# Altium schematic sheet Navigation_Controll.SchDoc
size A4
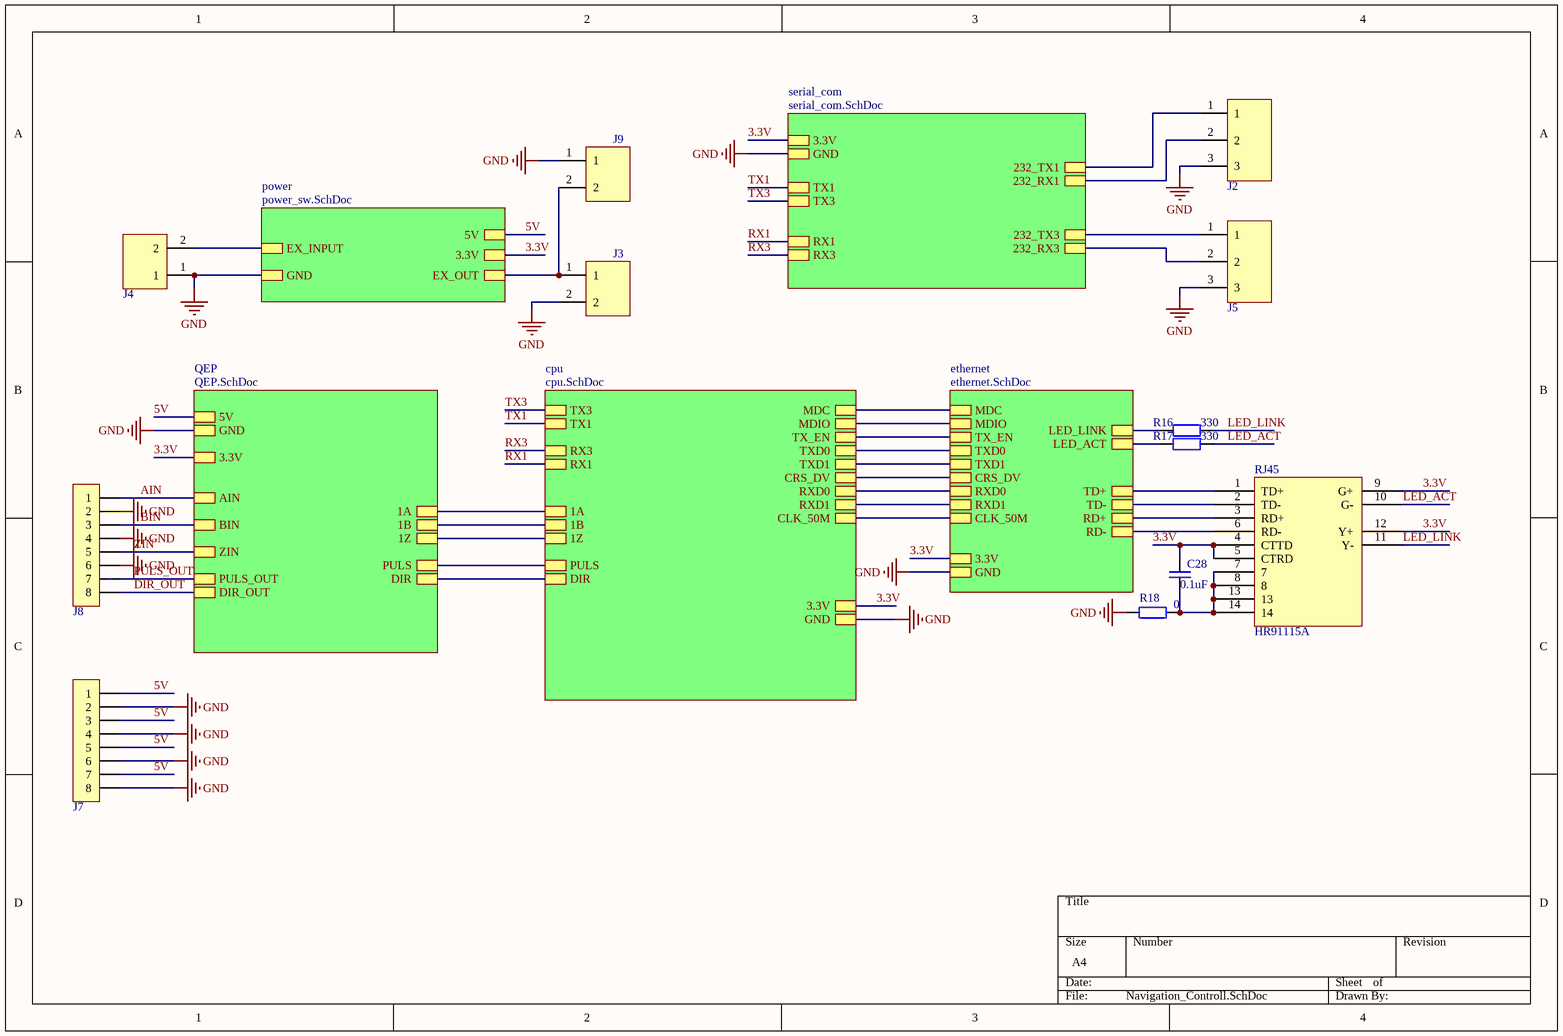
[diagram p0: Navigation_Controll.SchDoc]

## Parts
C28  value 0.1uF  [CAP-0805]  (hidden comment: CAP)
J2  DG3P  [DG381-3P]  (value not drawn)
J3  DG2P  [DG381-2P]  (value not drawn)
J4  DG2P  [DG508-2P]  (value not drawn)
J5  DG3P  [DG381-3P]  (value not drawn)
J7  HDR1*8  [KF128L-8P]  (value not drawn)
J8  HDR1*8  [KF128L-8P]  (value not drawn)
J9  DG2P  [DG381-2P]  (value not drawn)
R16  value 330  [RES-0805]  (hidden comment: RES)
R17  value 330  [RES-0805]  (hidden comment: RES)
R18  value 0  [RES-0805]  (hidden comment: RES)
RJ45  HR91115A  [RJ45_ISO]

## Sub-sheets
cpu = cpu.SchDoc: 1A, 1B, 1Z, PULS, DIR, TX3, TX1, RX3, RX1, MDC, MDIO, TX_EN, TXD0, TXD1, CRS_DV, RXD0, RXD1, CLK_50M, 3.3V, GND
ethernet = ethernet.SchDoc: MDC, MDIO, TX_EN, TXD0, TXD1, CRS_DV, RXD0, RXD1, CLK_50M, 3.3V, GND, LED_LINK, LED_ACT, TD+, TD-, RD+, RD-
power = power_sw.SchDoc: EX_INPUT, GND, 5V, 3.3V, EX_OUT
QEP = QEP.SchDoc: 5V, GND, 3.3V, AIN, BIN, ZIN, PULS_OUT, DIR_OUT, 1A, 1B, 1Z, PULS, DIR
serial_com = serial_com.SchDoc: 3.3V, GND, TX1, TX3, RX3, RX1, 232_TX1, 232_RX1, 232_TX3, 232_RX3

## Nets
GND: J2.3 J3.2 J4.1 J5.3 J7.2 J7.4 J7.6 J7.8 J8.2 J8.4 J8.6 J9.1 R18.1 ; sheet cpu/GND, sheet ethernet/GND, sheet power/GND, sheet serial_com/GND, sheet QEP/GND
3.3V: C28.2 RJ45.4(CTTD) RJ45.5(CTRD) RJ45.9(G+) RJ45.12(Y+) ; sheet cpu/3.3V, sheet ethernet/3.3V, sheet power/3.3V, sheet serial_com/3.3V, sheet QEP/3.3V
5V: J7.1 J7.3 J7.5 J7.7 ; sheet power/5V, sheet QEP/5V
AIN: J8.1 ; sheet QEP/AIN
BIN: J8.3 ; sheet QEP/BIN
DIR_OUT: J8.8 ; sheet QEP/DIR_OUT
LED_ACT: R17.2 RJ45.10(G-)
LED_LINK: R16.2 RJ45.11(Y-)
PULS_OUT: J8.7 ; sheet QEP/PULS_OUT
RX1: sheet cpu/RX1, sheet serial_com/RX1
RX3: sheet cpu/RX3, sheet serial_com/RX3
TX1: sheet cpu/TX1, sheet serial_com/TX1
TX3: sheet cpu/TX3, sheet serial_com/TX3
ZIN: J8.5 ; sheet QEP/ZIN
NetC28_1: C28.1 R18.2 RJ45.7 RJ45.8 RJ45.13 RJ45.14
NetJ2_1: J2.1 ; sheet serial_com/232_TX1
NetJ2_2: J2.2 ; sheet serial_com/232_RX1
NetJ3_1: J3.1 J9.2 ; sheet power/EX_OUT
NetJ4_2: J4.2 ; sheet power/EX_INPUT
NetJ5_1: J5.1 ; sheet serial_com/232_TX3
NetJ5_2: J5.2 ; sheet serial_com/232_RX3
NetR16_1: R16.1 ; sheet ethernet/LED_LINK
NetR17_1: R17.1 ; sheet ethernet/LED_ACT
NetRJ45_1: RJ45.1(TD+) ; sheet ethernet/TD+
NetRJ45_2: RJ45.2(TD-) ; sheet ethernet/TD-
NetRJ45_3: RJ45.3(RD+) ; sheet ethernet/RD+
NetRJ45_6: RJ45.6(RD-) ; sheet ethernet/RD-
(unnamed): sheet cpu/1A, sheet QEP/1A
(unnamed): sheet cpu/1B, sheet QEP/1B
(unnamed): sheet cpu/1Z, sheet QEP/1Z
(unnamed): sheet cpu/PULS, sheet QEP/PULS
(unnamed): sheet cpu/DIR, sheet QEP/DIR
(unnamed): sheet cpu/MDC, sheet ethernet/MDC
(unnamed): sheet cpu/MDIO, sheet ethernet/MDIO
(unnamed): sheet cpu/TX_EN, sheet ethernet/TX_EN
(unnamed): sheet cpu/TXD0, sheet ethernet/TXD0
(unnamed): sheet cpu/TXD1, sheet ethernet/TXD1
(unnamed): sheet cpu/CRS_DV, sheet ethernet/CRS_DV
(unnamed): sheet cpu/RXD0, sheet ethernet/RXD0
(unnamed): sheet cpu/RXD1, sheet ethernet/RXD1
(unnamed): sheet cpu/CLK_50M, sheet ethernet/CLK_50M

## Library data of the parts
RJ45 = NET_PORT